# Altium project CANLink.PrjPcb (part 2 of 2)

## Sheet PWR_MGMT.SchDoc
size B; SheetNumber: 4; SheetTotal: 6
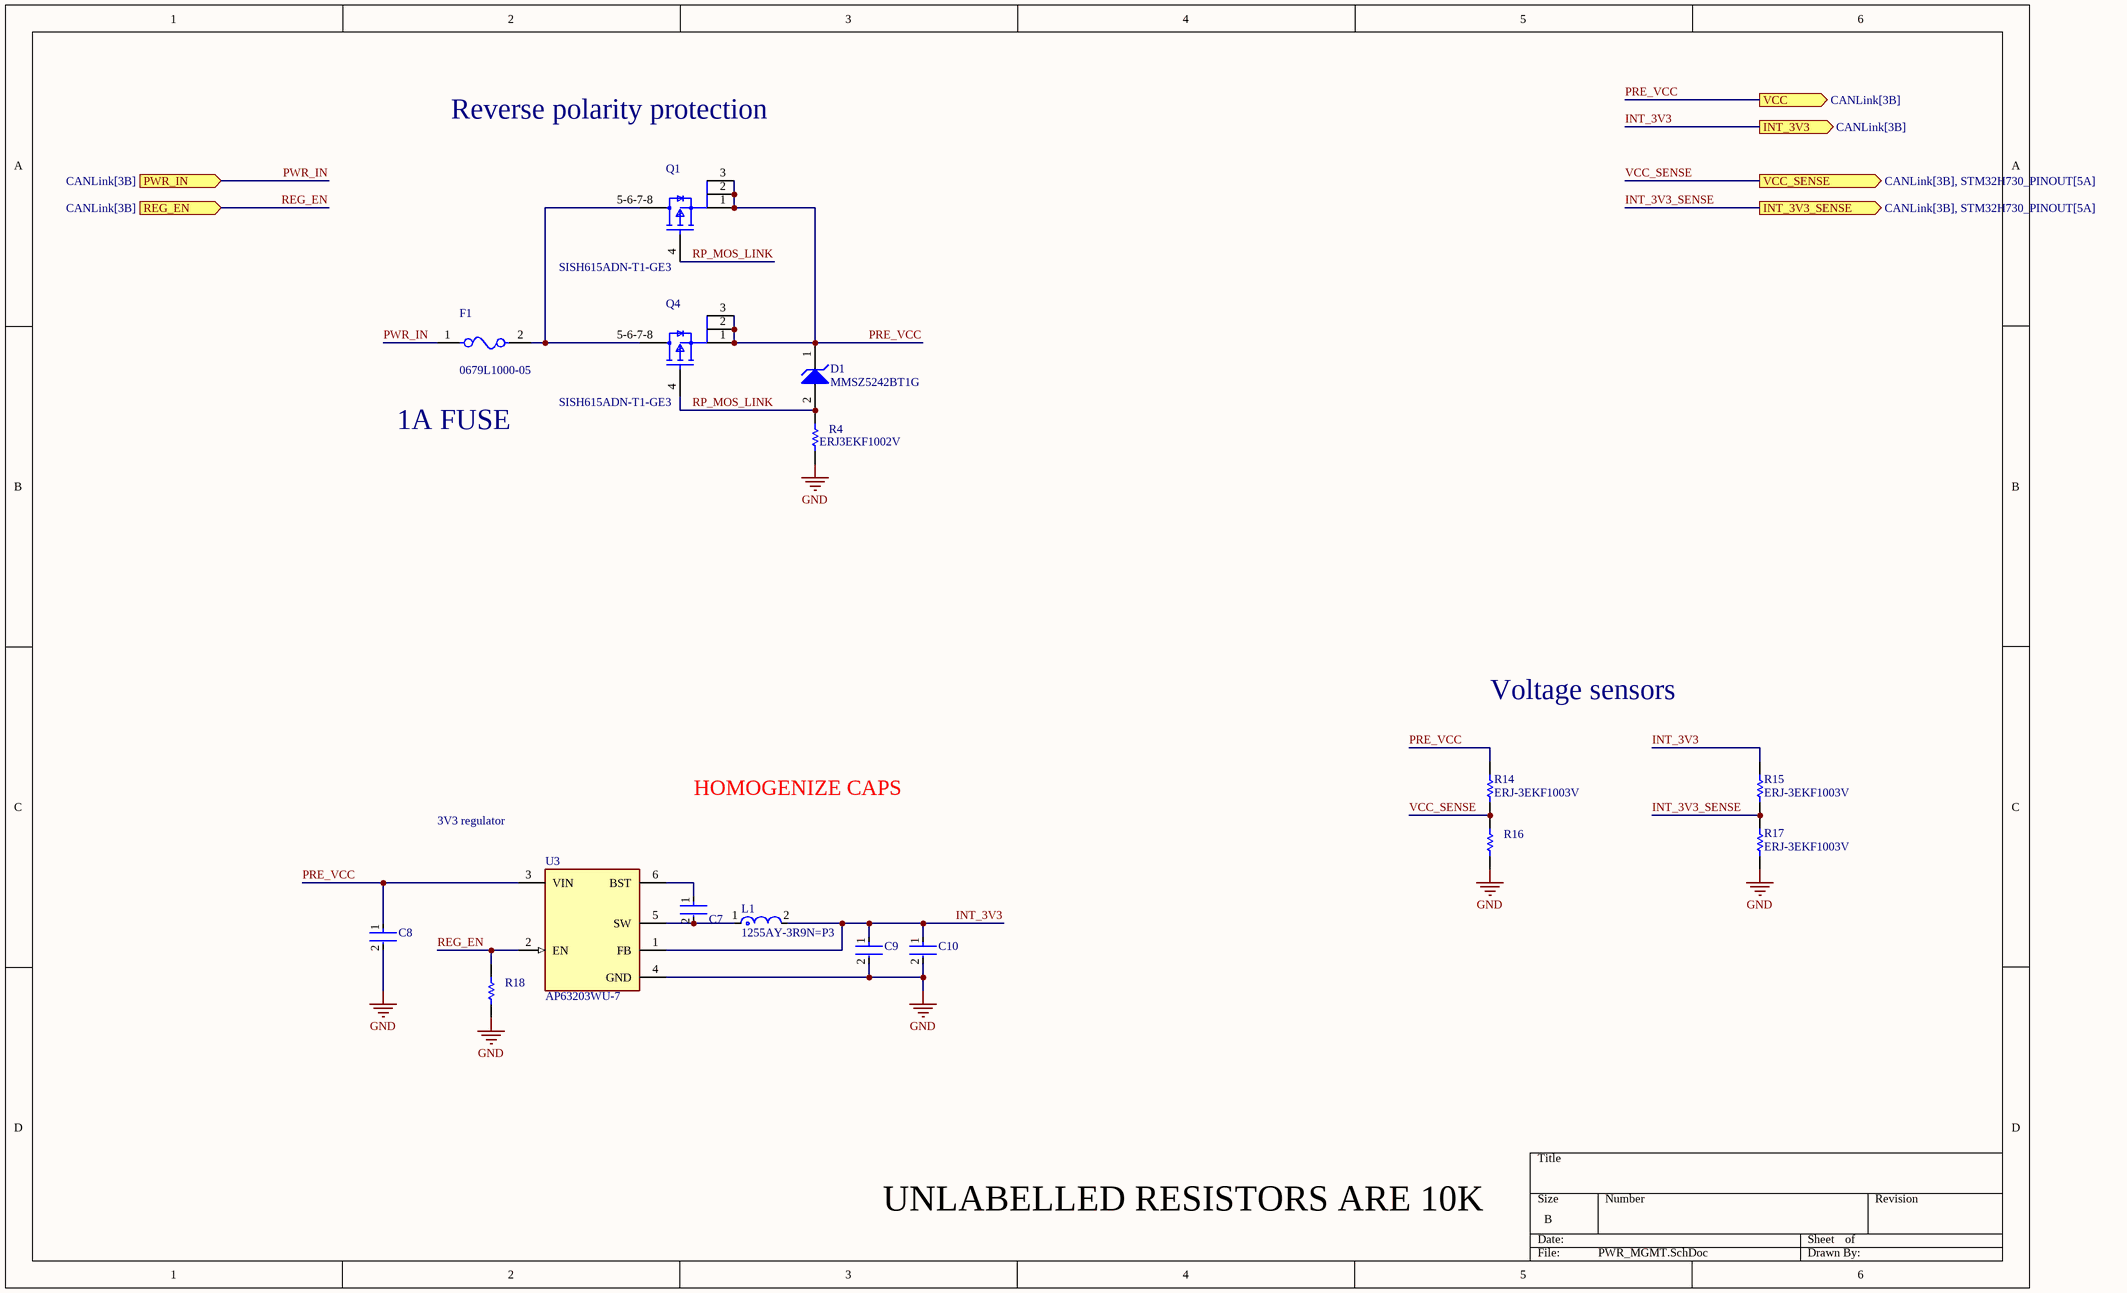
[diagram p7: PWR_MGMT.SchDoc]

### Parts
(Parts that share a designator on the sheet are numbered #1, #2 ... from top to bottom, then left to right.)
C7  C0402C104K8PACTU  [FP-C0402-BB-MFG]  (value not drawn)
C8  GRM188R60J106ME47D  [FP-GRM188-0_1-e0_2_0_55-IPC_A]  (value not drawn)
C9  GRM21BR61E226ME44L  [FP-GRM21B-0_2-e0_2_0_7-IPC_B]  (value not drawn)
C10  GRM21BR61E226ME44L  [FP-GRM21B-0_2-e0_2_0_7-IPC_B]  (value not drawn)
D1#2  MMSZ5242BT1G  [ONSC-SOD-123-2-425-04_V]
F1  0679L1000-05  [FP-0679L-MFG]
L1  1255AY-3R9N=P3  [FP-DG6045C-MFG]
Q1  SISH615ADN-T1-GE3  [SISH615ADN-T1-GE3-Footprint-1]
Q4  SISH615ADN-T1-GE3  [SISH615ADN-T1-GE3-Footprint-1]
R4#2  ERJ3EKF1002V  [RESC1609X55X30LL15T15]
R14  ERJ-3EKF1003V  [RESC1608X55X30ML15T15]
R15  ERJ-3EKF1003V  [RESC1608X55X30ML15T15]
R16  ERJ3EKF1002V  [RESC1609X55X30LL15T15]  (value not drawn)
R17  ERJ-3EKF1003V  [RESC1608X55X30ML15T15]
R18  ERJ3EKF1002V  [RESC1609X55X30LL15T15]  (value not drawn)
U3  AP63203WU-7  [FP-TSOT26-MFG]

### Ports
INT_3V3 (out, see CANLink[3B]), INT_3V3_SENSE (out, see CANLink[3B], STM32H730_PINOUT[5A]), PWR_IN (in, see CANLink[3B]), REG_EN (in, see CANLink[3B]), VCC (out, see CANLink[3B]), VCC_SENSE (out, see CANLink[3B], STM32H730_PINOUT[5A])

### Nets
GND: C8.2 C9.2 C10.2 R4#2.2 R16.2 R17.1 R18.2 U3.4(GND)
INT_3V3: C9.1 C10.1 L1.2 R15.2 U3.1(FB) ; port INT_3V3
PRE_VCC: C8.1 D1#2.1(K) Q1.1(S) Q1.2(S) Q1.3(S) Q4.1(S) Q4.2(S) Q4.3(S) R14.2 U3.3(VIN) ; port VCC
INT_3V3_SENSE: R15.1 R17.2 ; port INT_3V3_SENSE
PWR_IN: F1.1 ; port PWR_IN  [project net CAN0_V_SUP]
REG_EN: R18.1 U3.2(EN) ; port REG_EN
RP_MOS_LINK: D1#2.2(A) Q1.4(G) Q4.4(G) R4#2.1
VCC_SENSE: R14.1 R16.1 ; port VCC_SENSE
NetC7_1: C7.1 U3.6(BST)
NetC7_2: C7.2 L1.1 U3.5(SW)
NetF1_2: F1.2 Q1.5-6-7-8(D) Q4.5-6-7-8(D)

### Notes on the sheet
- Reverse polarity protection
- 1A FUSE
- Voltage sensors
- 3V3 regulator
- HOMOGENIZE CAPS
- UNLABELLED RESISTORS ARE 10K

### Library data of the parts
C7 = CMP-2008-02046-2: CAP CER 0.1UF 10V X5R 0402; Manufacturer: Kemet; Material: Ceramic; Capacitance: 0.10 μF; Temperature Coefficient: 15%; Tolerance: 0.1; Value: 0.10 μF; Package: C0402-BB; Temperature: -55°C to +125°C; ComponentLink2Description: Datasheet; Temperature Characteristic: X5R; Device Class L1: Passive Components; Height: 0.55mm; Lead Free: Yes; ComponentLink2URL: https://content.kemet.com/datasheets/KEM_C1002_X7R_SMD.pdf; Device Class L2: Capacitors; Temperature Range Low: -55°C; Temperature Range High: +125°C; RoHS: TRUE; Octopart: https://octopart.com/c0402c104k8pactu-kemet-140039; Automotive: No; Mouser Description: Capacitor 100 nF 10 VDC 0402; Category: Cap; Voltage Rating: 10 V; Digikey Description: CAP CER 0.1UF 10V X5R 0402; Ipc Land Pattern Name: CAPC10050X50; Device Class L3: Ceramic Capacitors; Manufacturer Part Number: C0402C104K8PACTU
C8 = CMP-2006-02792-2: Chip Multilayer Ceramic Capacitors for General Purpose, 0603, 10uF, X5R, 15%, 20%, 6.3V; Packaging: Tape and Reel; Voltage Rating (DC): 6.3V; Width: 0.031inch; Termination: SMD/SMT; Dielectric: X5R; Package Quantity: 4000; Voltage Rating: 6.3V; Capacitance: 10uF; Case/Package: 0603; Min Operating Temperature: -55°C; Voltage: 6.3V; Length: 1.6mm; Thickness: 0.035inch; Lead Free: Lead Free; Depth: 0.8mm; Case Code (Imperial): 0603; Max Operating Temperature: 85°C; Material: Ceramic; Height: 0.8mm; Tolerance: 20%; Mount: Surface Mount; REACH SVHC: No SVHC; Radiation Hardening: No; Case Code (Metric): 1608
C9 C10 = CMP-2007-03222-3: Chip Multilayer Ceramic Capacitors for General Purpose, 0805, 22uF, X5R, 15%, 20%, 25V; Case/Package: 0805; Depth: 1.25mm; Resistor Type: Ceramic; Voltage Rating: 25V; Lead Free: Lead Free; Voltage Rating (DC): 25V; Case Code (Metric): 2012; Thickness: 0.057inch; REACH SVHC: No SVHC; Material: Ceramic; Tolerance: 20%; Length: 2mm; Capacitance: 22uF; Case Code (Imperial): 0805; Max Operating Temperature: 85°C; Termination: SMD/SMT; Weight: 0.000335oz; Dielectric: X5R; Packaging: Tape and Reel; Voltage: 25V; Package Quantity: 3000; Height: 1.25mm; Mount: Surface Mount; Width: 1.25mm; Min Operating Temperature: -55°C
D1#2 = CMP-1060-00565-1: Zener Voltage Regulator, 500 mW, 2-Pin SOD-123, Pb-Free, Tape and Reel; Manufacturer: On Semiconductor; P Max (W): 0.5; VZ Typ (V): 12; PartNumber: MMSZ5242BT1G; PackageReference: SOD-123-2-425-04; ComponentLink3URL: http://www.onsemi.com/pub_link/Collateral/425-04.PDF; Mounting Technology: Surface Mount; ComponentLink2Description: Datasheet; ComponentLink1URL: http://www.onsemi.com/; ComponentLink3Description: Package Specification; PackageDescription: 2-Pin SOD, Body 1.6 x 2.69 mm; PackageVersion: Rev. G, 10/2009; ComponentLink1Description: Manufacturer URL; RoHS: Pb-Free; ComponentLink2URL: http://www.onsemi.com/pub_link/Collateral/MMSZ5221BT1-D.PDF; Packing: Tape and Reel; DatasheetVersion: Rev. 12
F1 = CMP-16042-000002-1: DIFF P#!!! / FUSE BRD MNT 1A 125VAC/VDC; Manufacturer: Bel Fuse; Manufacturer Part Number: 0679L9150-01; Max Fuse Ac Voltage: 125V; Fuse Blow Speed: Fast; Fuse Current: 15A; Fuse I2T: 103.5A2Sec; Fuse Interrupt Ac Current: 50A; Automotive Grade: Grade 1; Value: 0.0038Ω; Fuse Interrupt Dc Current: 300A; Fuse Voltage Drop: 0.13V; Device Class L2: Fuses; ComponentLink2URL: https://www.belfuse.com/resources/CircuitProtection/datasheets/0679L%20Sep2016.pdf; Package: 0679L; Height: 2.79mm; Digikey Description: FUSE BRD MNT 15A 125VAC/VDC; Temperature Range High: +125°C; Device Class L3: unset; Octopart: https://octopart.com/0679l9150-01-bel+fuse-70850665; Temperature Range Low: -55°C; Max Fuse Dc Voltage: 125V; Ipc Land Pattern Name: CAPC610254X254; Category: Fuse; Lead Free: Yes; Automotive: Yes; Resistance: 0.0038Ω; RoHS: TRUE; Device Class L1: Circuit Protection; ComponentLink2Description: Datasheet; Temperature: -55°C to +125°C; Voltage Rating: 125V
L1 = CMP-06042-002684-1: Shielded Wirewound Inductor 3.9uH 30% 4200mA 0.0264Ω SMD; Saturation Current: 4.7A; Test Frequency: 100kHz; Core Material: Ferrite; Current Rating: 4.2A; DC Resistance (DCR): 26.4mR; Inductance: 3.9uH; Resistor Type: Wirewound; Width: 0.248inch; Mount: Surface Mount; Tolerance: 30%; Packaging: Tape and Reel; Max Operating Temperature: 85°C; Shielding: Shielded; Length: 0.248inch; Min Operating Temperature: -40°C; Height - Seated (Max): 0.177inch; Case/Package: Nonstandard
Q1 Q4 = CMP-013-00036-2: Trans MOSFET P-CH 20V 22.1A 8-Pin PowerPAK 1212 EP T/R
R4#2 R16 R18 = CMP-1012-00623-3: Chip Resistor, 10 KOhm, +/- 1%, 0.1 W, -55 to 155 degC, 0603 (1608 Metric), RoHS, Tape and Reel; Manufacturer: Panasonic; Voltage Rating: 75V; Case\/Package: 0603; Power Rating: 100mW; Resistance: 10KOhm; Temperature Coefficient: 100ppm\/degreesC; Number of Pins: 2; Package Reference: 603; Depth: 0.8mm; Mount: SurfaceMount; Package Description: 2-Pin Surface Mount Device, Body 1.6 x 0.85 mm; Datasheet Version: 02/2017; Length: 1.6mm; Lead Free: LeadFree; Height: 0.45mm; Number of Terminations: 2; Max Power Dissipation: 100mW; Min Operating Temperature: -55degC; Datasheet URL: https://industrial.panasonic.com/cdbs/www-data/pdf/RDA0000/AOA0000C304.pdf; Termination: SMD/SMT; Case Code (Metric): 1608; Case Code (Imperial): 0603; Tolerance: 1%; Max Operating Temperature: 155degC; RoHSCompliant: true; Voltage Rating (DC): 75V; Radiation Hardening: No; Packaging: TapeandReel; Composition: ThickFilm; Mounting Technology: SurfaceMount; Manufacturer URL: http://www.panasonic.com/; Width: 0.031inch; REACH SVHC: NoSVHC; Contact Plating: Tin; Military Standard: Not; Package Quantity: 1
R14 R15 R17 = CMP-2000-00182-1: Manufacturer: Panasonic; Part Number: ERJ-3EKF1003V
U3 = CMP-12757-000006-1: IC REG BUCK 3.3V 2A TSOT26; Manufacturer: Diodes Inc.; Output Type: Fixed; Min Supply Voltage: 3.8V; Number Of Outputs: 1; Max Junction Temp: +160°C; Nominal Supply Current: 22uA; Standoff Height: 0.01mm; Switching Frequency: 1.1MHz; Max Supply Voltage: 32V; ComponentLink2Description: Datasheet; Device Class L1: Integrated Circuits (ICs); Temperature: to +160°C; Device Class L3: Voltage Regulators - Switching; RoHS: TRUE; Octopart: https://octopart.com/ap63203wu-7-diodes+inc.-98099550; Output Voltage: 3.3V; Lead Free: Yes; ComponentLink2URL: https://www.diodes.com/assets/Datasheets/AP63200-AP63201-AP63203-AP63205.pdf; Digikey Description: IC REG BUCK 3.3V 2A TSOT26; Footprint Url: https://www.diodes.com/assets/Package-Files/TSOT26.pdf; Ambient Temperature Range High: +85°C; Height: 1mm; Automotive: No; Temperature Range High: +160°C; Switching Topology: Buck; Output Current: 2A; Package: TSOT26; Category: IC; Mouser Description: AP63203 Series 3.3 V 2 A SMT Fixed Low IQ Synchronous Buck - TSOT-26; Device Class L2: Power Management ICs; Ambient Temperature Range Low: -40°C; Manufacturer Part Number: AP63203WU-7

## Sheet SWITCHES.SchDoc
size B; SheetNumber: 6; SheetTotal: 6
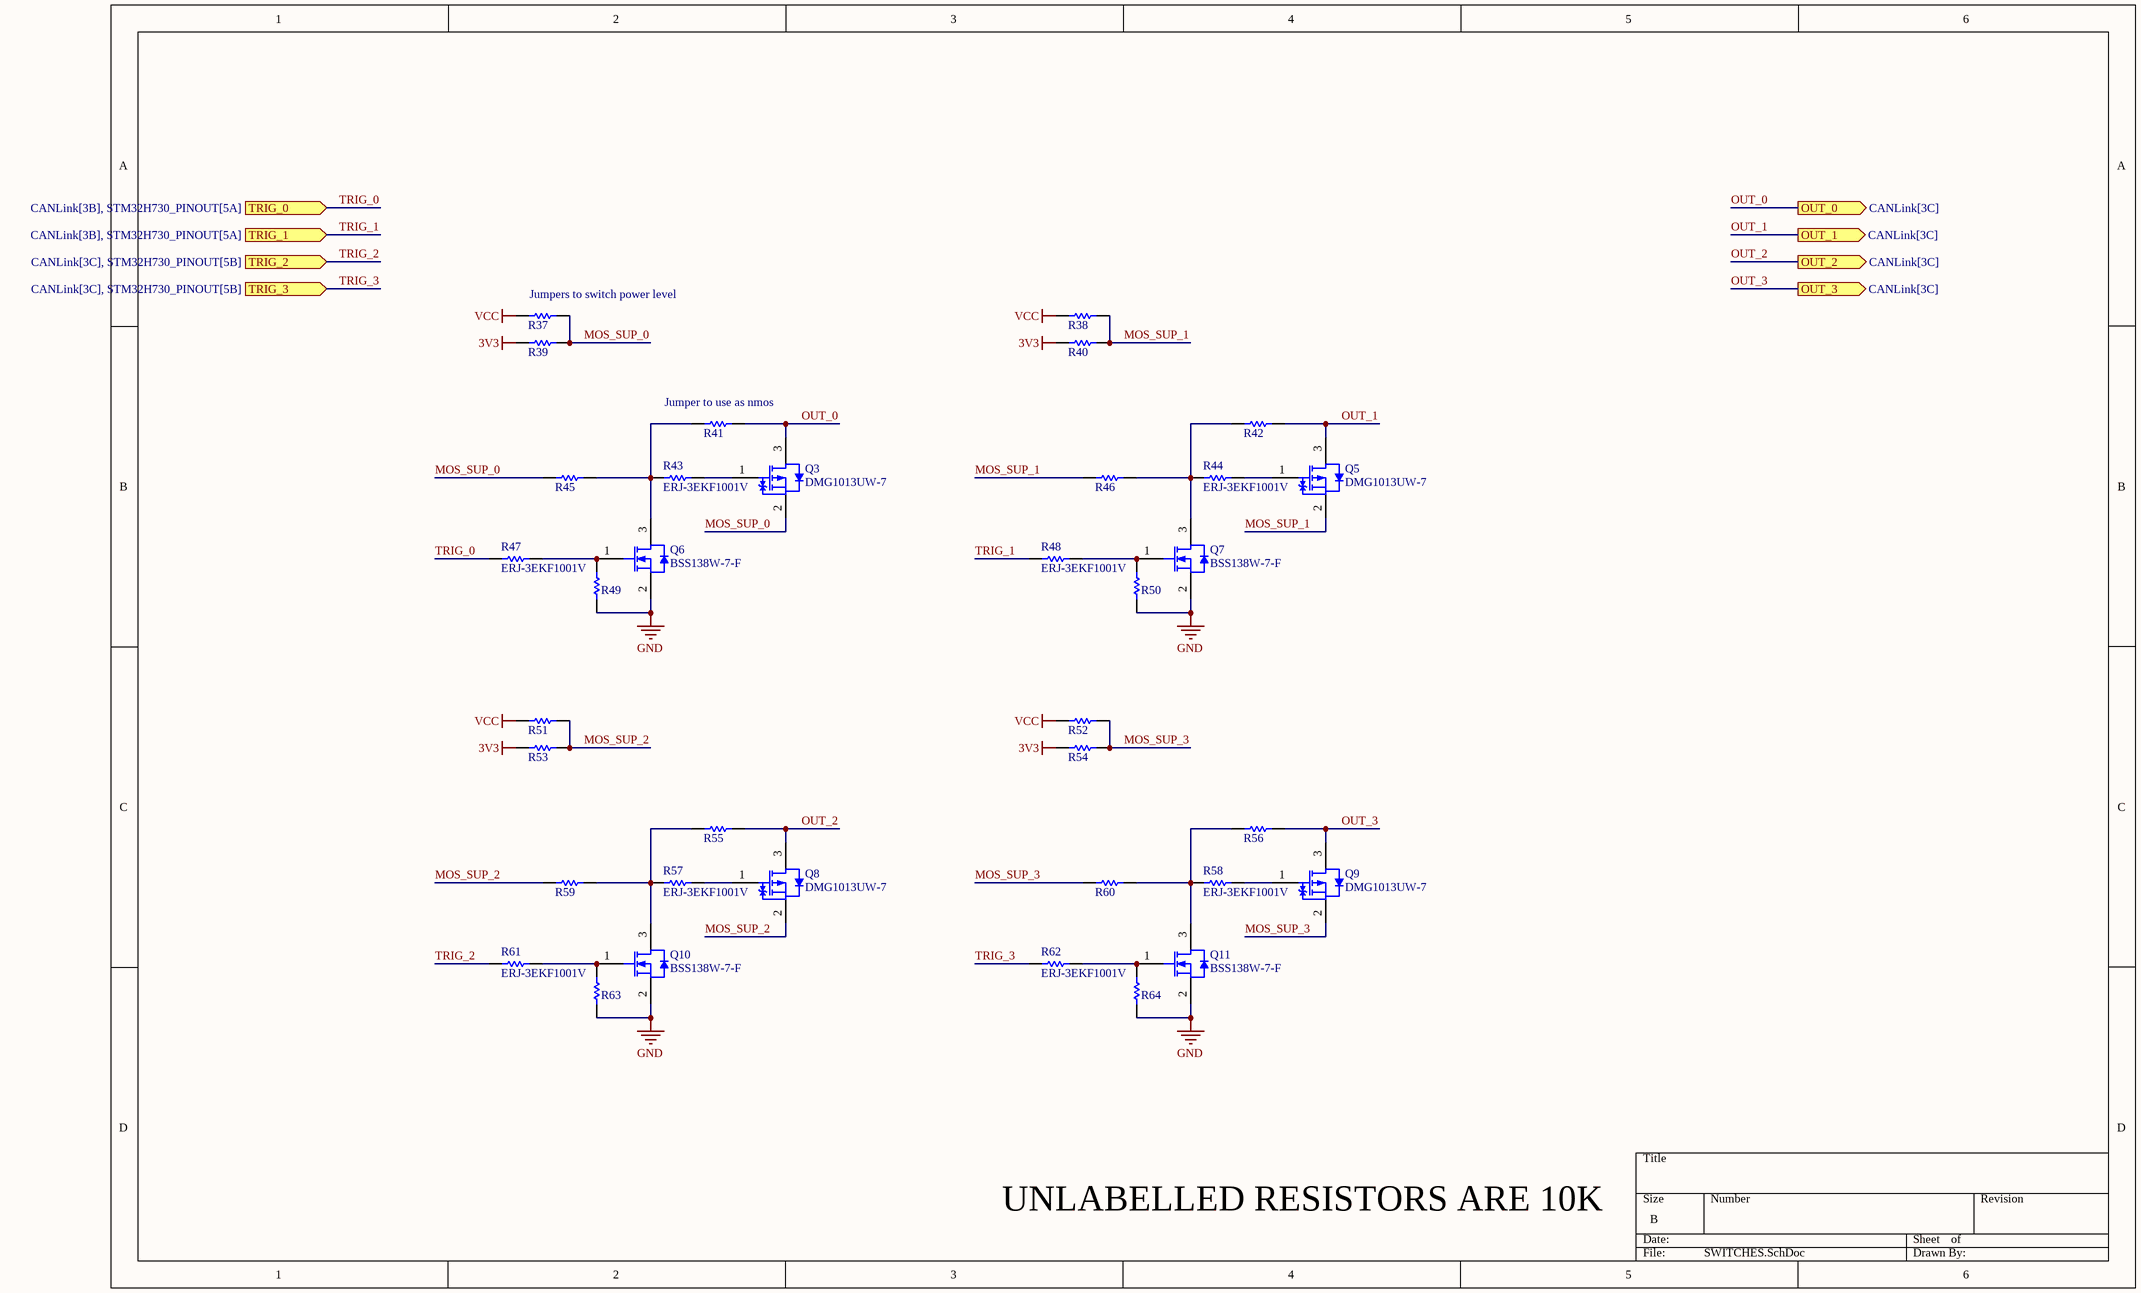
[diagram p8: SWITCHES.SchDoc]

### Parts
(Parts that share a designator on the sheet are numbered #1, #2 ... from top to bottom, then left to right.)
Q3#2  DMG1013UW-7  [DIOD-SOT323-3_V]
Q5  DMG1013UW-7  [DIOD-SOT323-3_V]
Q6  BSS138W-7-F  [DIOD-SOT323-3_V]
Q7  BSS138W-7-F  [DIOD-SOT323-3_V]
Q8  DMG1013UW-7  [DIOD-SOT323-3_V]
Q9  DMG1013UW-7  [DIOD-SOT323-3_V]
Q10  BSS138W-7-F  [DIOD-SOT323-3_V]
Q11  BSS138W-7-F  [DIOD-SOT323-3_V]
R37#2  0402 JUMPER 0 OHM  [RESC1005X40X25NL05T05]  (value not drawn)
R38#2  0402 JUMPER 0 OHM  [RESC1005X40X25NL05T05]  (value not drawn)
R39#2  0402 JUMPER 0 OHM  [RESC1005X40X25NL05T05]  (value not drawn)
R40#2  0402 JUMPER 0 OHM  [RESC1005X40X25NL05T05]  (value not drawn)
R41#2  0402 JUMPER 0 OHM  [RESC1005X40X25NL05T05]  (value not drawn)
R42#2  0402 JUMPER 0 OHM  [RESC1005X40X25NL05T05]  (value not drawn)
R43#2  ERJ-3EKF1001V  [RESC1608X55X30LL15T15]
R44#2  ERJ-3EKF1001V  [RESC1608X55X30LL15T15]
R45#2  ERJ3EKF1002V  [RESC1609X55X30LL15T15]  (value not drawn)
R46#2  ERJ3EKF1002V  [RESC1609X55X30LL15T15]  (value not drawn)
R47#2  ERJ-3EKF1001V  [RESC1608X55X30LL15T15]
R48#2  ERJ-3EKF1001V  [RESC1608X55X30LL15T15]
R49#2  ERJ3EKF1002V  [RESC1609X55X30LL15T15]  (value not drawn)
R50  ERJ3EKF1002V  [RESC1609X55X30LL15T15]  (value not drawn)
R51  0402 JUMPER 0 OHM  [RESC1005X40X25NL05T05]  (value not drawn)
R52  0402 JUMPER 0 OHM  [RESC1005X40X25NL05T05]  (value not drawn)
R53  0402 JUMPER 0 OHM  [RESC1005X40X25NL05T05]  (value not drawn)
R54  0402 JUMPER 0 OHM  [RESC1005X40X25NL05T05]  (value not drawn)
R55  0402 JUMPER 0 OHM  [RESC1005X40X25NL05T05]  (value not drawn)
R56  0402 JUMPER 0 OHM  [RESC1005X40X25NL05T05]  (value not drawn)
R57  ERJ-3EKF1001V  [RESC1608X55X30LL15T15]
R58  ERJ-3EKF1001V  [RESC1608X55X30LL15T15]
R59  ERJ3EKF1002V  [RESC1609X55X30LL15T15]  (value not drawn)
R60  ERJ3EKF1002V  [RESC1609X55X30LL15T15]  (value not drawn)
R61  ERJ-3EKF1001V  [RESC1608X55X30LL15T15]
R62  ERJ-3EKF1001V  [RESC1608X55X30LL15T15]
R63  ERJ3EKF1002V  [RESC1609X55X30LL15T15]  (value not drawn)
R64  ERJ3EKF1002V  [RESC1609X55X30LL15T15]  (value not drawn)

### Ports
OUT_0 (out, see CANLink[3C]), OUT_1 (out, see CANLink[3C]), OUT_2 (out, see CANLink[3C]), OUT_3 (out, see CANLink[3C]), TRIG_0 (in, see CANLink[3B], STM32H730_PINOUT[5A]), TRIG_1 (in, see CANLink[3B], STM32H730_PINOUT[5A]), TRIG_2 (in, see CANLink[3C], STM32H730_PINOUT[5B]), TRIG_3 (in, see CANLink[3C], STM32H730_PINOUT[5B])

### Nets
3V3: R39#2.1 R40#2.1 R53.1 R54.1  [project net INT_3V3]
GND: Q6.2(S) Q7.2(S) Q10.2(S) Q11.2(S) R49#2.1 R50.1 R63.1 R64.1
VCC: R37#2.1 R38#2.1 R51.1 R52.1  [project net PRE_VCC]
MOS_SUP_0: Q3#2.2(S) R37#2.2 R39#2.2 R45#2.2
MOS_SUP_1: Q5.2(S) R38#2.2 R40#2.2 R46#2.2
MOS_SUP_2: Q8.2(S) R51.2 R53.2 R59.2
MOS_SUP_3: Q9.2(S) R52.2 R54.2 R60.2
OUT_0: Q3#2.3(D) R41#2.2 ; port OUT_0
OUT_1: Q5.3(D) R42#2.2 ; port OUT_1
OUT_2: Q8.3(D) R55.2 ; port OUT_2
OUT_3: Q9.3(D) R56.2 ; port OUT_3
TRIG_0: R47#2.1 ; port TRIG_0
TRIG_1: R48#2.1 ; port TRIG_1
TRIG_2: R61.1 ; port TRIG_2
TRIG_3: R62.1 ; port TRIG_3
NetQ3#2_1: Q3#2.1(G) R43#2.2
NetQ5_1: Q5.1(G) R44#2.2
NetQ6_1: Q6.1(G) R47#2.2 R49#2.2
NetQ6_3: Q6.3(D) R41#2.1 R43#2.1 R45#2.1
NetQ7_1: Q7.1(G) R48#2.2 R50.2
NetQ7_3: Q7.3(D) R42#2.1 R44#2.1 R46#2.1
NetQ8_1: Q8.1(G) R57.2
NetQ9_1: Q9.1(G) R58.2
NetQ10_1: Q10.1(G) R61.2 R63.2
NetQ10_3: Q10.3(D) R55.1 R57.1 R59.1
NetQ11_1: Q11.1(G) R62.2 R64.2
NetQ11_3: Q11.3(D) R56.1 R58.1 R60.1

### Notes on the sheet
- (near R37#2) Jumpers to switch power level
- (near R41#2) Jumper to use as nmos
- UNLABELLED RESISTORS ARE 10K

### Library data of the parts
Q3#2 Q5 Q8 Q9 = CMP-2000-06170-1: P-Channel Enhancement Mode MOSFET, 310 mW, 20 V, -55 to 150 degC, 3-Pin SOT-323, RoHS, Tape and Reel; Manufacturer: Diodes Inc; Qg Gate Charge: 0.622nC; Drain-Source On Resistance-Max: 750mO; Rated Power Dissipation: 310mW; Drain-to-Source Voltage [Vdss]: 20V; Package Reference: SOT323; Datasheet Version: Rev. 3-2, 09/2013; Package Description: 3-Pin Small Outline Transistor, Body 2 x 1.25 mm, Pitch 0.65 mm; Mounting Technology: SurfaceMount; Manufacturer URL: http://www.diodes.com/; Datasheet URL: http://www.diodes.com/_files/datasheets/ds31861.pdf; Channel Type: P-Channel
Q6 Q7 Q10 Q11 = CMP-2000-05968-1: N-Channel Enhancement Mode Mosfet, 50 V, 200 mA, -55 to 150 degC, 6-Pin SOT-323, RoHS, Tape and Reel; Typical Turn-Off Delay Time: 20ns; Number of Channels: 1Channel; Type: EnhancementModeFieldEffectTransistor; Brand: DiodesIncorporated; Vds - Drain-Source Breakdown Voltage: 75V; Vgs - Gate-Source Voltage: 20V; Rds On - Drain-Source Resistance: 1.4Ohms; Transistor Type: 1N-Channel; Configuration: Single; Unit Weight: 0.000212oz; Pd - Power Dissipation: 200mW; Id - Continuous Drain Current: 200mA; Forward Transconductance - Min: 0.1S; Manufacturer URL: http://www.diodes.com/; Series: BSS138; Package Description: 3-Pin Small Outline Transistor, Body 2 x 1.25 mm, Pitch 0.65 mm; Mounting Technology: SurfaceMount; Product Category: MOSFET; RoHS: True; Maximum Operating Temperature: +150C; Height: 1mm; Length: 2.2mm; Technology: Si; Width: 1.35mm; Datasheet URL: http://www.diodes.com/_files/datasheets/ds30206.pdf; Manufacturer: DiodesIncorporated; Package / Case: SOT-323-3; Typical Turn-On Delay Time: 20ns; Transistor Polarity: N-Channel; Factory Pack Quantity: 3000; Packaging: Reel; Product: MOSFETSmallSignal; Datasheet Version: Rev. 11-2, 09/2013; Package Reference: SOT323; Minimum Operating Temperature: -55C; Mounting Style: SMD/SMT; Channel Mode: Enhancement
R37#2 R38#2 R39#2 R40#2 R41#2 R42#2 R51-R56 = CMP-009-00206-2: READ THE NAME
R43#2 R44#2 R47#2 R48#2 R57 R58 R61 R62 = CMP-2000-00180-1: Manufacturer: Panasonic; Part Number: ERJ-3EKF1001V
R45#2 R46#2 R49#2 R50 R59 R60 R63 R64 = CMP-1012-00623-3: as R4#2 on sheet PWR_MGMT; Number of Pins: 2; Package Reference: 603; Depth: 0.8mm; Mount: SurfaceMount; Package Description: 2-Pin Surface Mount Device, Body 1.6 x 0.85 mm; Datasheet Version: 02/2017; Length: 1.6mm; Lead Free: LeadFree; Height: 0.45mm; Number of Terminations: 2; Max Power Dissipation: 100mW; Min Operating Temperature: -55degC; Datasheet URL: https://industrial.panasonic.com/cdbs/www-data/pdf/RDA0000/AOA0000C304.pdf; Termination: SMD/SMT; Case Code (Metric): 1608; Case Code (Imperial): 0603; Tolerance: 1%; Max Operating Temperature: 155degC; RoHSCompliant: true; Voltage Rating (DC): 75V; Radiation Hardening: No; Packaging: TapeandReel; Composition: ThickFilm; Mounting Technology: SurfaceMount; Manufacturer URL: http://www.panasonic.com/; Width: 0.031inch; REACH SVHC: NoSVHC; Contact Plating: Tin; Military Standard: Not; Package Quantity: 1

## Nets that join several sheets
5V: CANLink (TP5.1), STM32H730_PINOUT (5 pins)
GND: CANLink (8 pins), STM32H730_PINOUT (64 pins), SD (6 pins), CAN_IF (7 pins), PWR_MGMT (8 pins), SWITCHES (8 pins)
INT_3V3: CANLink (TP4.1), STM32H730_PINOUT (40 pins), SD (6 pins), CAN_IF (C3.2 C4.2 U2.3 U2.5), PWR_MGMT (5 pins), SWITCHES (R39#2.1 R40#2.1 R53.1 R54.1)
PRE_VCC: CANLink (TP2.1), STM32H730_PINOUT (C41.2 LS1.P U7.3), PWR_MGMT (10 pins), SWITCHES (R37#2.1 R38#2.1 R51.1 R52.1)
AN_IO_0: CANLink (P1.6), STM32H730_PINOUT (U5.4)
AN_IO_1: CANLink (P1.3), STM32H730_PINOUT (U5.5)
AN_IO_2: CANLink (P1.4), STM32H730_PINOUT (U5.6)
AN_IO_3: CANLink (P1.1), STM32H730_PINOUT (U5.7)
AN_IO_4: CANLink (P1.2), STM32H730_PINOUT (U5.8)
CAN0_INH: CANLink (D1#1.2 TP1.1), STM32H730_PINOUT (U6.7)
CAN0_N: CANLink (J1.1), STM32H730_PINOUT (5 pins)
CAN0_P: CANLink (J1.4), STM32H730_PINOUT (5 pins)
CAN0_V_SUP: CANLink (J1.6), STM32H730_PINOUT (D7.2), PWR_MGMT (F1.1)
CAN1_N: CANLink (J2.1), CAN_IF (D9#2.2 R10.1 U2.12)
CAN1_P: CANLink (J2.4), CAN_IF (D9#2.1 R10.2 U2.13)
CAN1_RX: STM32H730_PINOUT (R6.1 U4.59), CAN_IF (U2.4)
CAN1_TX: STM32H730_PINOUT (R8.2 U4.60), CAN_IF (U2.1)
CAN_INH: CANLink (D2.2 TP7.1), CAN_IF (U2.7)
CAN_MISO: STM32H730_PINOUT (U4.53), CAN_IF (U2.6)
CAN_MOSI: STM32H730_PINOUT (U4.54), CAN_IF (U2.11)
CAN_nCS: STM32H730_PINOUT (U4.51), CAN_IF (U2.14)
CAN_PWR: CANLink (J2.6), CAN_IF (C5.2 R11.1 U2.10)
CAN_SCLK: STM32H730_PINOUT (U4.52), CAN_IF (U2.8)
INT_3V3_SENSE: STM32H730_PINOUT (U5.10), PWR_MGMT (R15.1 R17.2)
OUT_0: CANLink (P2.7), SWITCHES (Q3#2.3 R41#2.2)
OUT_1: CANLink (P2.5), SWITCHES (Q5.3 R42#2.2)
OUT_2: CANLink (P2.3), SWITCHES (Q8.3 R55.2)
OUT_3: CANLink (P2.1), SWITCHES (Q9.3 R56.2)
REG_EN: CANLink (D1#1.1 D2.1 TP6.1), PWR_MGMT (R18.1 U3.2)
SD_CLK: STM32H730_PINOUT (U4.78), SD (R1.1 SD1.5)
SD_CMD: STM32H730_PINOUT (R43#1.1 U4.80), SD (R2.1 SD1.3)
SD_CS: STM32H730_PINOUT (U4.77), SD (SD1.2)
SD_DAT0: STM32H730_PINOUT (R36.1 U4.79), SD (R3.1 SD1.7)
TRIG_0: STM32H730_PINOUT (U4.38), SWITCHES (R47#2.1)
TRIG_1: STM32H730_PINOUT (U4.39), SWITCHES (R48#2.1)
TRIG_2: STM32H730_PINOUT (U4.40), SWITCHES (R61.1)
TRIG_3: STM32H730_PINOUT (U4.41), SWITCHES (R62.1)
VCC_SENSE: STM32H730_PINOUT (U5.9), PWR_MGMT (R14.1 R16.1)